# EAGLE design logic_unit (EAGLE 7.2.0)
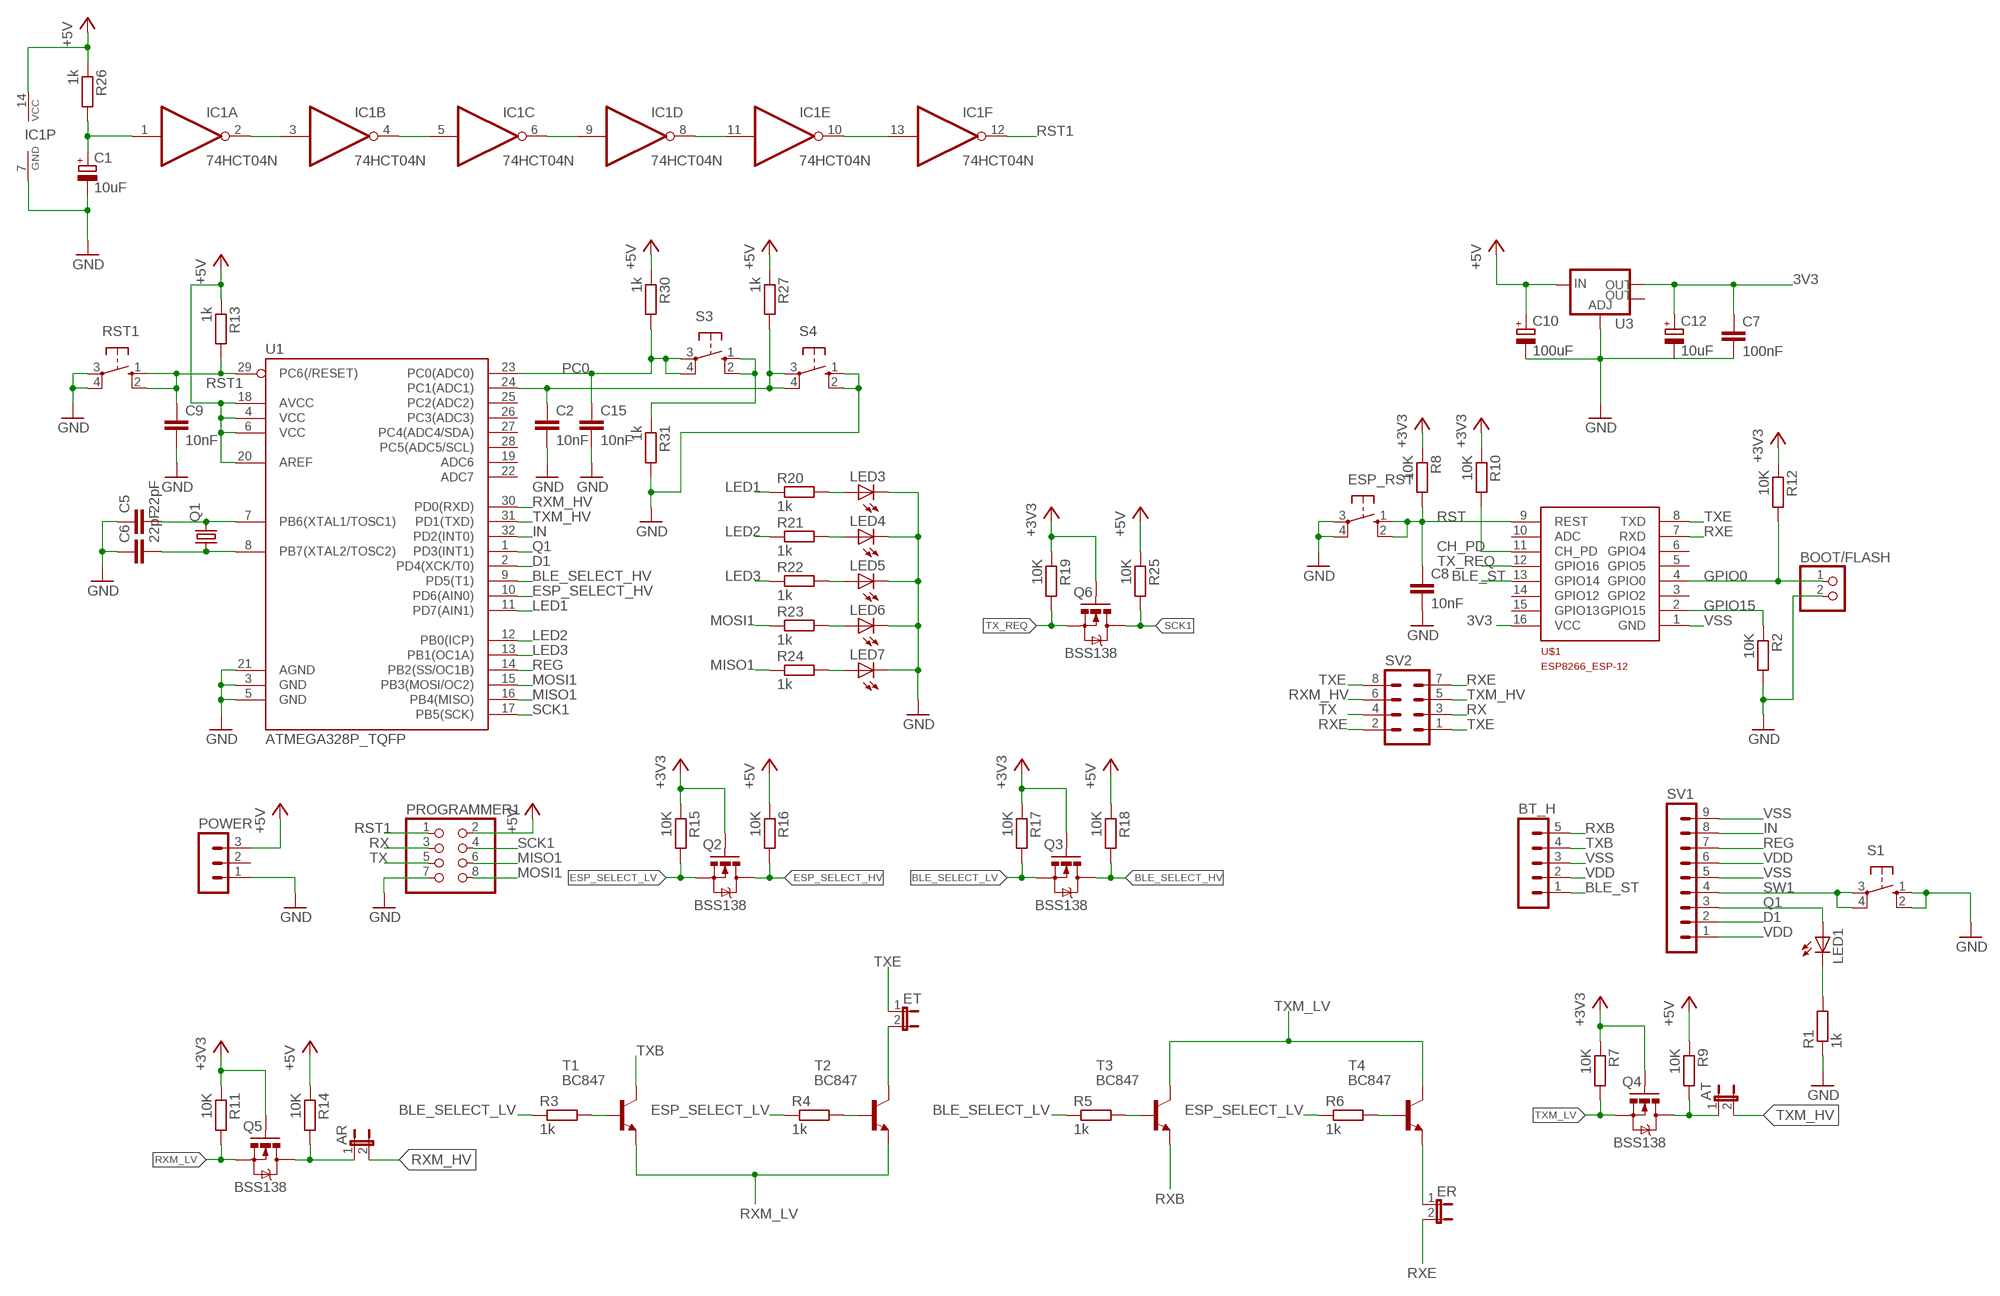
[diagram p0: schematic, sheet 1]

## Parts
AR  JP1E  [JP1]
AT  JP1E  [JP1]
BOOT/FLASH  PINHD-1X2  [1X02]
BT_H  MA05-1  [MA05-1]
C1  10uF  CPOL-EU153CLV-0405  [153CLV-0405]
C2  10nF  C-EUC1206  [C1206]
C5  22pF  C-EUC1206  [C1206]
C6  22pF  C-EUC1206  [C1206]
C7  100nF  C-EUC1206  [C1206]
C8  10nF  C-EUC1206  [C1206]
C9  10nF  C-EUC1206  [C1206]
C10  100uF  CPOL-EU153CLV-0605  [153CLV-0605]
C12  10uF  CPOL-EU153CLV-0405  [153CLV-0405]
C15  10nF  C-EUC1206  [C1206]
ER  JP1E  [JP1]
ESP_RST  10-XX  [B3F-10XX]
ET  JP1E  [JP1]
IC1  74HCT04N  [DIL14]
LED1  LED5MM  [LED5MM]
LED3  LED5MM  [LED5MM]
LED4  LED5MM  [LED5MM]
LED5  LED5MM  [LED5MM]
LED6  LED5MM  [LED5MM]
LED7  LED5MM  [LED5MM]
POWER  MA03-1  [MA03-1]
PROGRAMMER1  PINHD-2X4  [2X04]
Q1  CRYSTALHC49UP  [HC49UP]
Q2  BSS138  MOSFET-NCHANNELSMD  [SOT23-3]
Q3  BSS138  MOSFET-NCHANNELSMD  [SOT23-3]
Q4  BSS138  MOSFET-NCHANNELSMD  [SOT23-3]
Q5  BSS138  MOSFET-NCHANNELSMD  [SOT23-3]
Q6  BSS138  MOSFET-NCHANNELSMD  [SOT23-3]
R1  1k  R-EU_R1206  [R1206]
R2  10K  R-EU_R1206  [R1206]
R3  1k  R-EU_R1206  [R1206]
R4  1k  R-EU_R1206  [R1206]
R5  1k  R-EU_R1206  [R1206]
R6  1k  R-EU_R1206  [R1206]
R7  10K  R-EU_R1206  [R1206]
R8  10K  R-EU_R1206  [R1206]
R9  10K  R-EU_R1206  [R1206]
R10  10K  R-EU_R1206  [R1206]
R11  10K  R-EU_R1206  [R1206]
R12  10K  R-EU_R1206  [R1206]
R13  1k  R-EU_R1206  [R1206]
R14  10K  R-EU_R1206  [R1206]
R15  10K  R-EU_R1206  [R1206]
R16  10K  R-EU_R1206  [R1206]
R17  10K  R-EU_R1206  [R1206]
R18  10K  R-EU_R1206  [R1206]
R19  10K  R-EU_R1206  [R1206]
R20  1k  R-EU_R1206  [R1206]
R21  1k  R-EU_R1206  [R1206]
R22  1k  R-EU_R1206  [R1206]
R23  1k  R-EU_R1206  [R1206]
R24  1k  R-EU_R1206  [R1206]
R25  10K  R-EU_R1206  [R1206]
R26  1k  R-EU_R1206  [R1206]
R27  1k  R-EU_R1206  [R1206]
R30  1k  R-EU_R1206  [R1206]
R31  1k  R-EU_R1206  [R1206]
RST1  10-XX  [B3F-10XX]
S1  40-XX  [B3F-40XX]
S3  40-XX  [B3F-40XX]
S4  40-XX  [B3F-40XX]
SV1  MA09-1  [MA09-1]
SV2  MA04-2  [MA04-2]
T1  BC847  [SOT23]
T2  BC847  [SOT23]
T3  BC847  [SOT23]
T4  BC847  [SOT23]
U1  ATMEGA328P_TQFP  [TQFP32-08]
U3  V_REG_LM1117SOT223  [SOT223]
U$1  ESP8266_ESP-12  [ESP8266-ESP12]

## Nets
3V3: C7.1 C12.+ Q2.1(G) Q3.1(G) Q4.1(G) Q5.1(G) Q6.1(G) R7.1 R8.1 R10.1 R11.1 R12.1 R15.1 R17.1 R19.1 U3.2(OUT) U$1.16(VCC) ; supply symbol labelled +3V3
BLE_SELECT_HV: Q3.3(D) R18.2 U1.9(PD5(T1))
BLE_SELECT_LV: Q3.2(S) R3.1 R5.1 R17.2
BLE_ST: BT_H.1 U$1.13(GPIO14)
CH_PD: R10.2 U$1.11(CH_PD)
D1: SV1.2 U1.2(PD4(XCK/T0))
ESP_SELECT_HV: Q2.3(D) R16.2 U1.10(PD6(AIN0))
ESP_SELECT_LV: Q2.2(S) R4.1 R6.1 R15.2
GPIO0: BOOT/FLASH.1 R12.2 U$1.4(GPIO0)
GPIO15: R2.1 U$1.2(GPIO15)
IN: SV1.8 U1.32(PD2(INT0))
LED1: R20.1 U1.11(PD7(AIN1))
LED2: R21.1 U1.12(PB0(ICP))
LED3: R22.1 U1.13(PB1(OC1A))
MISO1: PROGRAMMER1.6 R24.1 U1.16(PB4(MISO))
MOSI1: PROGRAMMER1.8 R23.1 U1.15(PB3(MOSI/OC2))
N$1: R3.2 T1.1(B)
N$2: R4.2 T2.1(B)
N$3: R5.2 T3.1(B)
N$4: IC1.2(A:O) IC1.3(B:I)
N$5: LED1.K(C) R1.2
N$6: R6.2 T4.1(B)
N$7: IC1.4(B:O) IC1.5(C:I)
N$8: IC1.6(C:O) IC1.9(D:I)
N$9: IC1.8(D:O) IC1.11(E:I)
N$10: IC1.10(E:O) IC1.13(F:I)
N$11: C1.+ IC1.1(A:I) R26.2
N$12: C5.2 Q1.2 U1.7(PB6(XTAL1/TOSC1))
N$13: C2.1 R27.2 S4.3(P) S4.4(P1) U1.24(PC1(ADC1))
N$19: C6.2 Q1.1 U1.8(PB7(XTAL2/TOSC2))
N$25: LED3.A R20.2
N$30: LED4.A R21.2
N$33: LED5.A R22.2
N$36: LED6.A R23.2
N$39: LED7.A R24.2
N$45: R31.1 S3.1(S) S3.2(S1)
PC0: C15.1 R30.2 S3.3(P) S3.4(P1) U1.23(PC0(ADC0))
Q1: LED1.A SV1.3 U1.1(PD3(INT1))
REG: SV1.7 U1.14(PB2(SS/OC1B))
RST: C8.1 ESP_RST.1(S) ESP_RST.2(S1) R8.2 U$1.9(REST)
RST1: C9.1 IC1.12(F:O) PROGRAMMER1.1 R13.2 RST1.1(S) RST1.2(S1) U1.29(PC6(/RESET))
RX: PROGRAMMER1.3 SV2.3
RXB: BT_H.5 T3.2(E)
RXE: ER.2 SV2.2 SV2.7 U$1.7(RXD)
RXE_J: ER.1 T4.2(E)
RXM_HV: AR.2 SV2.6 U1.30(PD0(RXD))
RXM_HV_J: AR.1 Q5.3(D) R14.2
RXM_LV: Q5.2(S) R11.2 T1.2(E) T2.2(E)
SCK1: PROGRAMMER1.4 Q6.3(D) R25.2 U1.17(PB5(SCK))
SW1: S1.3(P) S1.4(P1) SV1.4
TX: PROGRAMMER1.5 SV2.4
TX_REQ: Q6.2(S) R19.2 U$1.12(GPIO16)
TXB: BT_H.4 T1.3(C)
TXE: ET.1 SV2.1 SV2.8 U$1.8(TXD)
TXE_J: ET.2 T2.3(C)
TXM_HV: AT.2 SV2.5 U1.31(PD1(TXD))
TXM_HV_J: AT.1 Q4.3(D) R9.2
TXM_LV: Q4.2(S) R7.2 T3.3(C) T4.3(C)
VDD: BT_H.2 C10.+ IC1.14(P:VCC) POWER.3 PROGRAMMER1.2 R9.1 R13.1 R14.1 R16.1 R18.1 R25.1 R26.1 R27.1 R30.1 SV1.1 SV1.6 U1.4(VCC) U1.6(VCC) U1.18(AVCC) U1.20(AREF) U3.3(IN) ; supply symbol labelled +5V
VSS: BOOT/FLASH.2 BT_H.3 C1.- C2.2 C5.1 C6.1 C7.2 C8.2 C9.2 C10.- C12.- C15.2 ESP_RST.3(P) ESP_RST.4(P1) IC1.7(P:GND) LED3.K(C) LED4.K(C) LED5.K(C) LED6.K(C) LED7.K(C) POWER.1 PROGRAMMER1.7 R1.1 R2.2 R31.2 RST1.3(P) RST1.4(P1) S1.1(S) S1.2(S1) S4.1(S) S4.2(S1) SV1.5 SV1.9 U1.3(GND) U1.5(GND) U1.21(AGND) U3.1(ADJ) U$1.1(GND) ; supply symbol labelled GND
Unconnected: POWER.2 U1.19(ADC6) U1.22(ADC7) U1.25(PC2(ADC2)) U1.26(PC3(ADC3)) U1.27(PC4(ADC4/SDA)) U1.28(PC5(ADC5/SCL)) U3.4(OUT) U$1.3(GPIO2) U$1.5(GPIO5) U$1.6(GPIO4) U$1.10(ADC) U$1.14(GPIO12) U$1.15(GPIO13)

## Library data of the parts
AR AT ER ET = jumper:JP1E: JUMPER
BOOT/FLASH = pinhead:PINHD-1X2: PIN HEADER
BT_H = con-lstb:MA05-1: PIN HEADER; OC_FARNELL: unknown; OC_NEWARK: unknown
C1 C10 C12 = resistor:CPOL-EU: POLARIZED CAPACITOR, European symbol
C2 C5-C9 C15 = rcl:C-EU: CAPACITOR, European symbol
ESP_RST RST1 = switch-omron:10-XX: OMRON SWITCH; MPN: B3F-1000; OC_FARNELL: 176432; OC_NEWARK: 36M3542
IC1 = 74xx-eu:74*04: Hex INVERTER
LED1 LED3-LED7 = adafruit:LED: LED OSRAM: - CHIPLED LG R971, LG N971, LY N971, LG Q971, LY Q971, LO R971, LY R971 LH N974, LH R974 LS Q976, LO Q976, LY Q976 LO Q996 - Hyper CHIPLED LW Q18S LB Q993, LB Q99A, LB R99A - SideLED LS A670, LO A670, LY A670, LG A670, LP A670 LB A673, LV A673, LT A673, LW A673 LH A674 LY A675 LS A676, LA A676, LO A676, LY A676, LW A676 LS A679, LY A679, LG A679 - Hyper Micro SIDELED® LS Y876, LA Y876, LO Y876, LY Y876 LT Y87S - SmartLED LW L88C, LW L88S LB L89C, LB L89S, LG L890 LS L89K, LO L89K, LY L89K LS L896, LA L896, LO L896, LY L896 - TOPLED LS T670, LO T670, LY T670, LG T670, LP T670 LSG T670, LSP T670, LSY T670, LOP T670, LYG T670 LG T671, LOG T671, LSG T671 LB T673, LV T673, LT T673, LW T673 LH T674 LS T676, LA T676, LO T676, LY T676, LB T676, LH T676, LSB T676, LW T676 LB T67C, LV T67C, LT T67C, LS T67K, LO T67K, LY T67K, LW E67C LS E67B, LA E67B, LO E67B, LY E67B, LB E67C, LV E67C, LT E67C LW T67C LS T679, LY T679, LG T679 LS T770, LO T770, LY T770, LG T770, LP T770 LB T773, LV T773, LT T773, LW T773 LH T774 LS E675, LA E675, LY E675, LS T675 LS T776, LA T776, LO T776, LY T776, LB T776 LHGB T686 LT T68C, LB T68C - Hyper Mini TOPLED® LB M676 - Mini TOPLED Santana® LG M470 LS M47K, LO M47K, LY M47K Source: http://www.osram.convergy.de/
POWER = con-lstb:MA03-1: PIN HEADER; OC_FARNELL: unknown; OC_NEWARK: unknown
PROGRAMMER1 = pinhead:PINHD-2X4: PIN HEADER
Q1 = crystal:CRYSTAL: CRYSTAL; OC_FARNELL: unknown; OC_NEWARK: unknown
Q2-Q6 = SparkFun:MOSFET-NCHANNEL
R1-R27 R30 R31 = rcl:R-EU_: RESISTOR, European symbol
S1 S3 S4 = switch-omron:40-XX: OMRON SWITCH; MF: OMRON COMPONENTS USA; MPN: B3F-4000; OC_FARNELL: 176434; OC_NEWARK: 36K3105
SV1 = con-lstb:MA09-1: PIN HEADER; OC_FARNELL: unknown; OC_NEWARK: unknown
SV2 = con-lstb:MA04-2: PIN HEADER; OC_FARNELL: unknown; OC_NEWARK: unknown
T1-T4 = transistor-neu-to92:BC847: NPN TRANSISTOR
U1 = SparkFun-DigitalIC:ATMEGA328P_TQFP; PROD_ID: IC-09069
U3 = SparkFun-PowerIC:V_REG_LM1117: Voltage Regulator LM1117 Standard adjustable voltage regulator but in SMD form. Spark Fun Electronics SKU : COM-00595; PROD_ID: VREG-08170
U$1 = ESP8266-ESP12:ESP8266_ESP-12

## Board
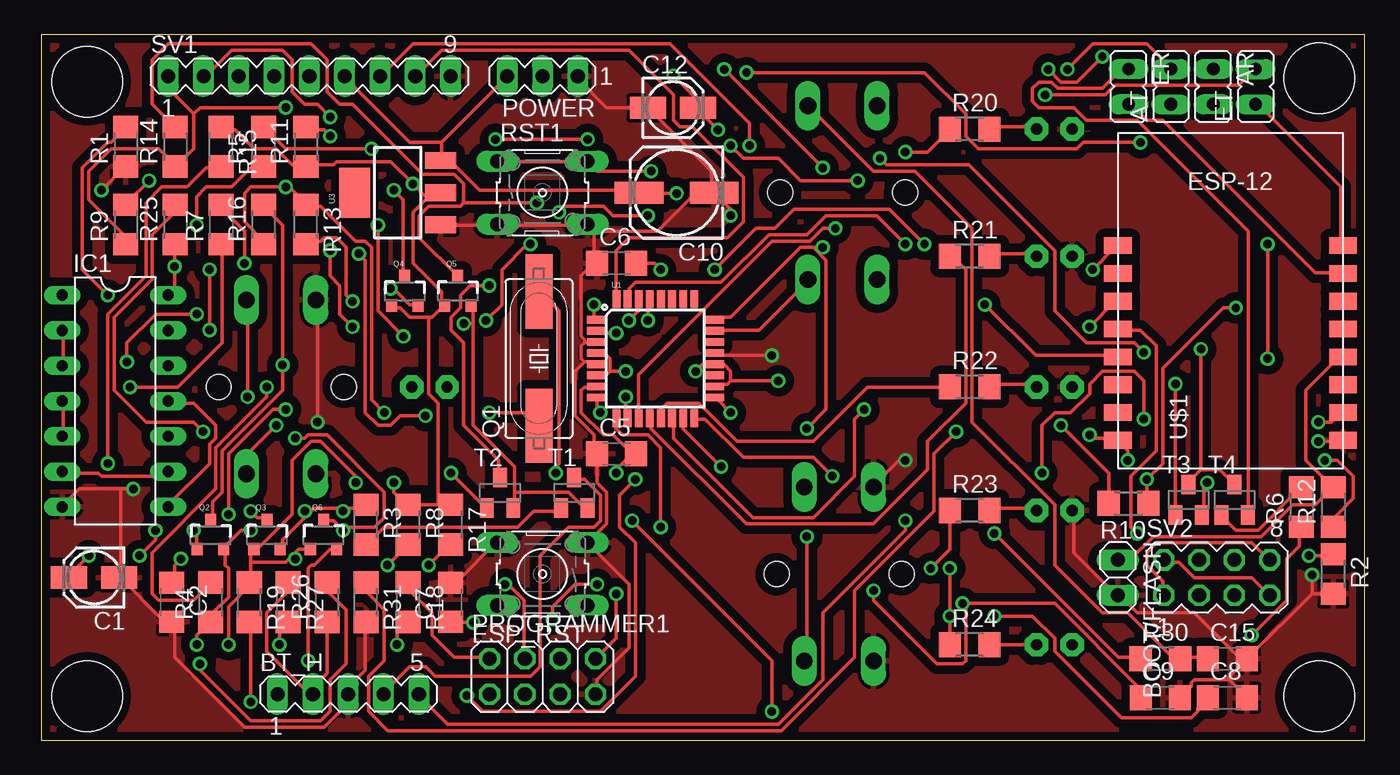
[diagram p1: board, top side]
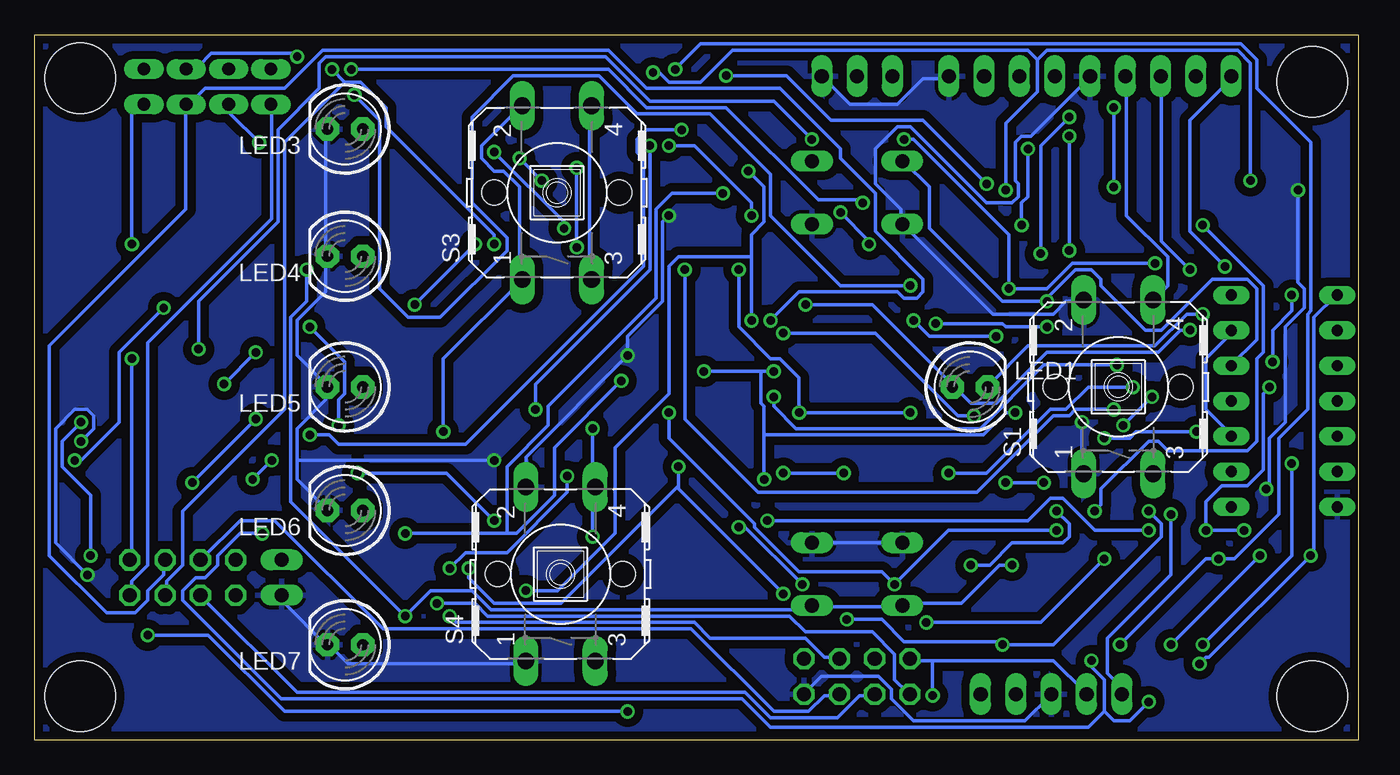
[diagram p2: board, bottom side, seen from below]

Size 95.23 x 50.72 mm. Coordinates in mm from the lower left corner, seen from the top.
Outline: 0,0 95.23,0 95.23,50.72 0,50.72 0,0
Copper layers (1*16): Top 0.035mm / dielectric 1.5mm / Bottom 0.035mm
Design rules "default *": minimum track width 10mil, minimum drill 24mil, track to track 8mil, track to pad 8mil, pad to pad 8mil, via to via 8mil, smd to smd 8mil, copper to edge 20mil, drill to drill 8mil, minimum pad ring 10mil, minimum via ring 8mil, stop-mask expansion 4mil, vias tented up to drill 0mil, thermal gap 10mil
Holes 5.08 mm at 3.31,47.36 91.95,47.61 91.95,3.16 3.31,3.16

### Footprints (pad centres in the part's own frame; a part is rotated, then mirrored left to right if it is on the bottom)
JP1 = drill 0.914 long: 1 0,-1.27; 2 0,1.27
1X02 = drill 1.016 long: 1 -1.27,0; 2 1.27,0
MA05-1 = drill 1.016 long: 1 -5.08,0; 2 -2.54,0; 3 0,0; 4 2.54,0; 5 5.08,0
153CLV-0405 = smd 2.6 x 1.6: + 1.8,0; - -1.8,0
C1206 = smd 1.6 x 1.8: 1 -1.4,0; 2 1.4,0
153CLV-0605 = smd 3.5 x 1.6: + 2.7,0; - -2.7,0
B3F-10XX = drill 1.016 long: 1 -3.251,2.261; 2 3.251,2.261; 3 -3.251,-2.261; 4 3.251,-2.261
DIL14 = drill 0.813 long: 1 -7.62,-3.81; 2 -5.08,-3.81; 3 -2.54,-3.81; 4 0,-3.81; 5 2.54,-3.81; 6 5.08,-3.81; 7 7.62,-3.81; 8 7.62,3.81; 9 5.08,3.81; 10 2.54,3.81; 11 0,3.81; 12 -2.54,3.81; 13 -5.08,3.81; 14 -7.62,3.81
LED5MM = drill 0.813 pad 1.676 octagon: A -1.27,0; K 1.27,0
MA03-1 = drill 1.016 long: 1 -2.54,0; 2 0,0; 3 2.54,0
2X04 = drill 1.016 octagon: 1 -3.81,-1.27; 2 -3.81,1.27; 3 -1.27,-1.27; 4 -1.27,1.27; 5 1.27,-1.27; 6 1.27,1.27; 7 3.81,-1.27; 8 3.81,1.27
HC49UP = smd 5.334 x 1.93: 1 -4.826,0; 2 4.826,0
SOT23-3 = smd 0.8 x 0.9: 1 -0.95,-1; 2 0.95,-1; 3 0,1.1
R1206 = smd 1.6 x 1.803: 1 -1.422,0; 2 1.422,0
B3F-40XX = drill 1.194 long: 1 -6.248,2.489; 2 6.248,2.489; 3 -6.248,-2.489; 4 6.248,-2.489 | hole 1.803: 0,-4.496; 0,4.496
MA09-1 = drill 1.016 long: 1 -10.16,0; 2 -7.62,0; 3 -5.08,0; 4 -2.54,0; 5 0,0; 6 2.54,0; 7 5.08,0; 8 7.62,0; 9 10.16,0
MA04-2 = drill 1.016 octagon: 1 -3.81,-1.27; 2 -3.81,1.27; 3 -1.27,-1.27; 4 -1.27,1.27; 5 1.27,-1.27; 6 1.27,1.27; 7 3.81,-1.27; 8 3.81,1.27
SOT23 = smd 1 x 1.4: 1 -0.95,-1.1; 2 0.95,-1.1; 3 0,1.1
TQFP32-08 = smd 1.27 x 0.559: 1 -4.293,2.8; 2 -4.293,2; 3 -4.293,1.2; 4 -4.293,0.4; 5 -4.293,-0.4; 6 -4.293,-1.2; 7 -4.293,-2; 8 -4.293,-2.8; 17 4.293,-2.8; 18 4.293,-2; 19 4.293,-1.2; 20 4.293,-0.4; 21 4.293,0.4; 22 4.293,1.2; 23 4.293,2; 24 4.293,2.8 | smd 0.559 x 1.27: 9 -2.8,-4.293; 10 -2,-4.293; 11 -1.2,-4.293; 12 -0.4,-4.293; 13 0.4,-4.293; 14 1.2,-4.293; 15 2,-4.293; 16 2.8,-4.293; 25 2.8,4.293; 26 2,4.293; 27 1.2,4.293; 28 0.4,4.293; 29 -0.4,4.293; 30 -1.2,4.293; 31 -2,4.293; 32 -2.8,4.293
SOT223 = smd 1.219 x 2.235: 1 -2.311,-3.099; 2 0,-3.099; 3 2.311,-3.099 | smd 3.6 x 2.2: 4 0,3.099
ESP8266-ESP12 = smd 2 x 1.2: 1 16.2,2; 2 16.2,4; 3 16.2,6; 4 16.2,8; 5 16.2,10; 6 16.2,12; 7 16.2,14; 8 16.2,16; 9 0,16; 10 0,14; 11 0,12; 12 0,10; 13 0,8; 14 0,6; 15 0,4; 16 0,2

### Placement (x,y rotation side)
AR  84.33,46.99 180 top
AT  81.28,46.99 0 top
BOOT/FLASH  77.47,11.68 270 top
BT_H  22.1,3.3 0 top
C1  3.81,11.68 180 top
C2  9.4,9.91 270 top
C5  41.4,20.57 0 top
C6  41.4,34.29 0 top
C7  29.46,9.91 90 top
C8  85.34,3.05 0 top
C9  80.52,3.05 0 top
C10  45.72,39.37 180 top
C12  45.47,45.47 0 top
C15  85.34,5.84 0 top
ER  78.23,46.99 180 top
ESP_RST  36.07,11.94 180 top
ET  87.38,46.99 0 top
IC1  5.33,24.38 270 top
LED1  27.94,25.4 0 bottom
LED3  72.9,43.94 180 bottom
LED4  72.9,34.8 180 bottom
LED5  72.9,25.4 180 bottom
LED6  72.9,16.51 180 bottom
LED7  72.9,6.86 180 bottom
POWER  36.07,47.75 180 top
PROGRAMMER1  36.07,4.57 0 top
Q1  35.81,27.43 90 top
Q2  12.19,14.73 0 top
Q3  16.26,14.73 0 top
Q4  26.16,32.26 0 top
Q5  29.97,32.26 0 top
Q6  20.32,14.73 0 top
R1  6.1,42.67 90 top
R2  92.96,11.94 270 top
R3  23.37,15.49 270 top
R4  12.19,9.91 90 top
R5  16,42.67 90 top
R6  90.68,16.76 90 top
R7  12.95,37.08 90 top
R8  26.42,15.49 270 top
R9  6.1,37.08 90 top
R10  78.23,17.02 180 top
R11  19.05,42.67 90 top
R12  92.96,16.76 90 top
R13  19.05,37.08 270 top
R14  9.65,42.67 90 top
R15  12.95,42.67 270 top
R16  16,37.08 90 top
R17  29.46,15.49 270 top
R18  26.42,9.91 270 top
R19  14.99,9.91 270 top
R20  66.8,43.94 0 top
R21  66.8,34.8 0 top
R22  66.8,25.4 0 top
R23  66.8,16.51 0 top
R24  66.8,6.86 0 top
R25  9.65,37.08 90 top
R26  20.57,9.91 90 top
R27  17.78,9.91 270 top
R30  80.52,5.84 0 top
R31  23.37,9.91 270 top
RST1  36.07,39.37 0 top
S1  17.27,25.4 90 bottom
S3  57.66,39.37 90 bottom
S4  57.4,11.94 90 bottom
SV1  19.3,47.75 0 top
SV2  84.58,11.68 0 top
T1  38.35,17.78 0 top
T2  33.02,17.78 0 top
T3  82.55,17.27 0 top
T4  85.85,17.27 0 top
U1  44.2,27.43 0 top
U3  25.65,39.37 90 top
U$1  77.47,19.56 0 top

### Tracks (layer width: path | path; a pad name or v marks a point on that pad's centre or on a via)
3V3  (via drill 0.61)
  Top 0.254: v78.18,20.12 78.18,20.8 77.5,21.49 U$1.16 77.27,21.72 75.67,21.72 v75.44,21.95 | R10.1 79.55,17.14 v79.55,18.75 80.7,19.89 80.7,26.75 85.04,31.09 v85.95,31.09 | v92.35,20.12 93.27,20.12 94.41,18.97 94.41,17.37 93.04,16 93.04,15.54 R12.1 | v10.97,15.09 11.2,14.86 11.2,13.95 Q2.1 | v6.4,25.38 9.83,25.38 13.03,28.57 13.03,35.66 R7.1 | 15.09,12.8 15.09,11.43 R19.1 15.09,11.2 13.49,9.6 v13.49,6.86 | 15.09,12.8 15.09,13.72 Q3.1 15.32,13.95 15.77,13.95 18.06,16.23 18.06,20.12 19.43,21.49 20.12,21.49 22.63,18.97 v22.63,18.52 | 18.06,13.26 17.6,12.8 15.09,12.8 | 18.06,13.26 18.52,13.72 19.2,13.72 Q6.1 | v31.09,8.46 29.49,8.46 C7.1 | 18.06,13.26 v18.29,13.03 | R15.1 13.03,43.89 13.95,43.89 15.32,42.52 16.92,42.52 18.06,41.38 18.97,41.38 R11.1 19.2,41.38 21.03,41.38 21.26,41.6 25.15,41.6 v26.75,40.01 27.66,39.09 27.89,39.09 | 28.57,16.92 29.26,16.92 R17.1 28.57,16.92 | 28.57,16.92 26.52,16.92 R8.1 26.29,16.92 25.38,17.83 v25.38,18.52 | 27.89,30.4 28.12,30.4 28.8,31.09 Q5.1 28.8,31.32 28.8,32.23 26.75,34.29 26.75,37.95 27.89,39.09 | 27.89,30.4 26.52,30.4 25.83,31.09 25.38,31.09 Q4.1 | 27.89,39.09 28.12,39.32 28.57,39.32 U3.2 27.89,39.09 | v45.49,47.78 47.09,46.18 47.09,45.49 C12.+ 47.32,45.26 v48.69,43.89 | 28.57,16.92 28.57,24.23 27.89,24.92 27.89,30.4 | v8.23,15.09 8.23,14.4 v7.09,13.26
  Bottom 0.254: v78.18,20.12 v79.55,18.75 | v92.35,20.12 91.9,20.12 89.15,22.86 89.15,27.89 v85.95,31.09 | v6.4,25.38 6.86,24.92 6.86,19.43 8,18.29 9.83,18.29 10.97,17.14 v10.97,15.09 v8.23,15.09 | v31.09,8.46 22.86,8.46 v18.29,13.03 | v45.49,47.78 41.15,47.78 37.95,44.58 31.32,44.58 v26.75,40.01 | v25.38,18.52 v22.63,18.52 | v13.49,6.86 v7.09,13.26 | v75.44,21.95 74.07,21.95 73.38,21.26 64.24,21.26 51.44,34.06 51.44,41.83 51.89,42.29 51.89,43.2 51.21,43.89 v48.69,43.89
BLE_SELECT_HV  (via drill 0.61)
  Top 0.254: v15.09,16.46 15.54,16 16.23,16 Q3.3 | v25.6,6.86 25.6,7.77 26.29,8.46 R18.2 | v44.58,15.32 44.58,21.03 43.66,21.95 41.83,21.95 41.38,22.4 41.38,23.09 U1.9 | v40.01,11.2 38.41,11.2 36.8,9.6 v36.8,8.69
  Bottom 0.254: v15.09,16.46 14.17,15.54 14.17,14.63 21.95,6.86 v25.6,6.86 25.83,7.09 32.69,7.09 34.29,8.69 v36.8,8.69 | v44.58,15.32 44.12,15.32 v40.01,11.2
BLE_SELECT_LV  (via drill 0.61)
  Top 0.254: 19.2,16.23 19.66,16.69 21.72,16.69 | 19.2,16.23 17.37,14.4 17.37,13.95 Q3.2 | 21.72,16.69 23.32,16.69 R3.1 | v11.2,37.03 11.2,39.09 11.89,39.78 13.72,39.78 15.09,41.15 16,41.15 R5.1 | 19.2,16.23 v18.97,16.46 | v27.89,12.57 29.26,13.95 R17.2 | 21.72,16.69 v21.72,16.46
  Bottom 0.254: v11.2,37.03 6.86,32.69 6.86,27.89 7.32,27.43 7.32,21.49 8,20.8 13.72,20.8 14.4,21.49 15.09,21.49 18.52,18.06 18.52,16.92 v18.97,16.46 | v27.89,12.57 26.52,12.57 24.92,14.17 21.26,14.17 20.8,14.63 20.8,15.54 v21.72,16.46
BLE_ST  (via drill 0.61)
  Top 0.254: v67.89,31.32 71.55,27.66 77.27,27.66 U$1.13 | v63.55,35.66 61.04,38.18 54.18,38.18 52.81,36.8 51.44,36.8 v48.46,33.83 | v17.6,23.77 16.69,23.77 13.49,20.57 v13.49,16.23
  Bottom 0.254: v63.55,35.66 v67.89,31.32 | v48.46,33.83 48.46,23.09 43.2,17.83 27.43,17.83 21.95,23.32 20.8,23.32 20.34,23.77 v17.6,23.77 | v13.49,16.23 13.49,11.89 18.06,7.32 18.06,4.8 17.14,3.89 17.14,3.43 BT_H.1
CH_PD  (via drill 0.61)
  Top 0.254: v73.38,22.63 76.81,19.2 76.81,17.14 R10.2 | v75.44,29.72 77.27,31.55 U$1.11
  Bottom 0.254: v73.38,22.63 73.38,24.46 72.92,24.92 72.92,27.2 v75.44,29.72
D1  (via drill 0.61)
  Top 0.254: v41.38,29.26 40.01,29.26 U1.2 | v27.66,23.32 25.83,23.32 25.15,22.63 24.23,22.63 23.32,23.55 23.32,34.52 v22.86,34.98 | v20.8,44.81 19.89,45.72 18.97,45.72 18.06,46.63 18.06,48.92 17.37,49.61 13.72,49.61 11.89,47.78 SV1.2
  Bottom 0.254: v41.38,29.26 34.75,29.26 28.8,23.32 v27.66,23.32 | v22.86,34.98 22.86,42.75 v20.8,44.81
ESP_SELECT_HV  (via drill 0.61)
  Top 0.254: Q2.3 12.34,16 12.34,17.14 13.03,17.83 13.03,20.8 17.37,25.15 v17.37,26.98 17.37,37.03 16,38.41 R16.2 | v42.06,24.69 42.06,23.32 U1.10
  Bottom 0.254: v42.06,24.69 42.06,24 40.46,22.4 27.2,22.4 22.63,26.98 v17.37,26.98
ESP_SELECT_LV  (via drill 0.61)
  Top 0.254: v4.8,19.89 4.8,30.63 7.54,33.38 7.54,38.63 8.69,39.78 10.52,39.78 11.89,41.15 12.8,41.15 R15.2 | v11.2,6.86 11.2,7.54 12.12,8.46 R4.1 12.34,8.69 12.34,9.14 13.49,10.29 13.49,12.34 13.26,12.57 13.26,13.72 Q2.2 13.26,13.95 14.4,15.09 v15.09,15.09 | v87.1,7.54 89.61,10.06 89.61,13.03 90.53,13.95 90.53,15.32 R6.1 | v52.58,2.06 52.58,5.71 v42.52,15.77
  Bottom 0.254: v4.8,19.89 4.8,13.26 v11.2,6.86 | v87.1,7.54 82.75,7.54 77.27,2.06 v52.58,2.06 | v42.52,15.77 23.77,15.77 22.17,17.37 21.26,17.37 18.97,15.09 v15.09,15.09
GPIO0
  Top 0.254: U$1.4 93.5,27.66 90.98,25.15 90.98,20.12 92.81,18.29 R12.2 92.81,18.06 91.67,16.92 90.07,16.92 87.78,14.63 80.01,14.63 78.41,13.03 77.5,13.03 BOOT/FLASH.1
GPIO15  (via drill 0.61)
  Top 0.254: v91.21,13.26 92.81,13.26 R2.1 | v91.9,22.86 92.81,22.86 93.5,23.55 U$1.2
  Bottom 0.254: v91.21,13.26 91.21,17.6 93.27,19.66 93.27,21.49 v91.9,22.86
IN
  Top 0.254: U1.32 41.38,31.77 41.38,35.2 42.29,36.12 49.38,36.12 50.52,37.26 50.52,40.46 46.86,44.12 45.95,44.12 45.49,44.58 45.49,46.41 42.29,49.61 28.8,49.61 26.98,47.78 SV1.8
LED1  (via drill 0.61)
  Top 0.254: v57.15,36.8 56.24,36.8 55.32,35.89 52.58,35.89 42.98,26.29 42.98,23.32 U1.11 | v62.18,42.29 63.78,42.29 65.38,43.89 R20.1
  Bottom 0.254: v57.15,36.8 57.15,37.26 v62.18,42.29
LED2
  Top 0.254: U1.12 43.89,23.09 43.89,22.4 50.75,15.54 59.89,15.54 63.78,19.43 63.78,21.49 66.52,24.23 66.52,33.83 65.61,34.75 R21.1
LED3
  Top 0.254: U1.13 44.58,23.32 44.58,23.77 45.03,24.23 47.32,24.23 50.06,21.49 55.55,21.49 59.44,25.38 65.38,25.38 R22.1
MISO1  (via drill 0.61)
  Top 0.254: v56.92,18.97 55.55,20.34 50.52,20.34 47.78,23.09 47.09,23.09 U1.16 | R24.1 v65.38,8.91 v65.38,12.34 | R24.1
  Bottom 0.254: v56.92,18.97 56.92,17.83 61.27,13.49 64.24,13.49 v65.38,12.34 | v65.38,8.91 64.92,8.46 47.78,8.46 46.63,7.32 39.78,7.32 38.41,5.94 37.49,5.94 PROGRAMMER1.6
MOSI1  (via drill 0.61)
  Top 0.254: v48.92,19.66 46.18,22.4 46.18,23.09 U1.15 | v41.38,10.52 41.38,7.32 40.01,5.94 PROGRAMMER1.8 | v64.01,12.34 65.38,13.72 65.38,16.46 R23.1
  Bottom 0.254: 48.92,18.29 48.92,18.06 v41.38,10.52 | 48.92,18.29 v48.92,19.66 | v64.01,12.34 64.01,11.66 62.18,9.83 57.38,9.83 48.92,18.29
N$1
  Top 0.254: T1.1 37.26,16.46 35.43,16.46 34.29,15.32 24.69,15.32 23.55,14.17 R3.2
N$2  (via drill 0.61)
  Top 0.254: v29.49,19.2 32,16.69 T2.1 | v16.23,25.38 16.23,24.69 12.57,21.03 12.57,18.06 8,13.49 8,10.52 8.46,10.06 10.97,10.06 12.12,11.2 R4.2
  Bottom 0.254: v29.49,19.2 26.75,19.2 22.17,23.77 21.03,23.77 19.43,25.38 v16.23,25.38
N$3  (via drill 0.61)
  Top 0.254: v81.61,25.6 81.61,16.23 T3.1 | v79.32,27.89 78.64,28.57 75.21,28.57 72.92,30.86 72.92,35.2 66.75,41.38 60.81,41.38 v60.35,41.83 | v58.75,40.23 54.63,40.23 53.03,41.83 50.52,41.83 v49.61,42.75 | v43.66,37.72 41.15,37.72 40.46,38.41 37.72,38.41 v37.26,37.95 | v35.2,35.66 34.98,35.66 33.15,33.83 33.15,31.32 v32,30.18 | v26.06,29.03 24.23,30.86 v24.23,37.03 | v23.77,42.52 17.6,42.52 16,44.12 R5.2
  Bottom 0.254: v79.32,27.89 v81.61,25.6 | v58.75,40.23 v60.35,41.83 | v49.61,42.75 47.78,42.75 43.66,38.63 v43.66,37.72 | v37.26,37.95 35.2,35.89 v35.2,35.66 | v32,30.18 30.86,29.03 v26.06,29.03 | v24.23,37.03 24.23,38.63 23.77,39.09 v23.77,42.52
N$4
  Top 0.254: IC1.3 1.6,26.98 1.6,29.26 IC1.2
N$5  (via drill 0.61)
  Top 0.254: v4.8,32 2.97,33.83 2.97,41.15 4.8,42.98 5.03,42.98 5.94,43.89 R1.2 | v6.17,27.2 6.17,28.57 8.23,30.63 v11.2,30.63
  Bottom 0.254: v4.8,32 4.8,30.86 6.17,29.49 v6.17,27.2 | v11.2,30.63 12.34,30.63 14.63,28.35 23.77,28.35 26.52,25.6 LED1.K
N$6
  Top 0.254: T4.1 85.04,16 85.95,15.09 87.55,15.09 90.53,18.06 R6.2
N$7
  Top 0.254: IC1.5 1.6,21.95 1.6,24.23 IC1.4
N$8
  Top 0.254: IC1.6 1.6,19.2 4.12,19.2 4.34,18.97 8.91,18.97 9.14,19.2 IC1.9
N$9
  Top 0.254: IC1.8 9.14,16.92 12.12,19.89 12.12,21.26 12.57,21.72 12.57,22.63 10.97,24.23 9.14,24.23 IC1.11
N$10
  Bottom 0.254: IC1.10 9.14,21.95 10.97,23.77 10.97,27.43 9.14,29.26 IC1.13
N$11  (via drill 0.61)
  Top 0.254: R26.2 20.57,10.74 21.95,9.37 21.95,5.49 20.8,4.34 20.8,2.06 20.12,1.37 15.09,1.37 11.43,5.03 v11.43,5.49 | v3.43,13.26 2.06,11.89 C1.+
  Bottom 0.254: v11.43,5.49 10.97,5.94 10.74,5.94 v3.43,13.26 3.2,13.49 3.2,30.4 1.6,32 IC1.1
N$12  (via drill 0.61)
  Top 0.254: 42.52,20.57 41.15,21.95 40.46,21.95 38.86,23.55 38.86,25.15 39.09,25.38 39.78,25.38 U1.7 | 42.52,20.57 C5.2 42.75,20.57 | 42.52,20.57 41.38,19.43 v41.38,19.2 | v37.03,19.2 37.03,19.66 37.26,19.89 37.26,30.86 35.89,32.23 Q1.2
  Bottom 0.254: v37.03,19.2 v41.38,19.2
N$13  (via drill 0.61)
  Top 0.254: v10.06,13.03 9.6,12.57 9.6,11.43 C2.1 | v17.14,6.86 17.14,8 17.6,8.46 R27.2 | 55.55,35.43 54.63,35.43 49.61,30.4 48.69,30.4 U1.24 | 55.55,35.43 56.46,34.52 56.46,23.77 v55.09,22.4 | v55.09,14.63 55.09,5.71 S4.3 | v56.24,41.15 v49.15,48.23 | 55.55,35.43 v56.24,35.43
  Bottom 0.254: v17.14,6.86 10.97,13.03 v10.06,13.03 8.91,13.03 5.71,16.23 5.71,21.72 3.66,23.77 3.66,30.63 3.43,30.86 3.43,42.98 7.32,46.86 7.32,48.92 8.46,50.06 47.32,50.06 v49.15,48.23 | v55.09,22.4 55.09,18.29 S4.4 55.09,18.06 v55.09,14.63 | v56.24,35.43 v56.24,41.15
N$19  (via drill 0.61)
  Top 0.254: v40.23,23.55 40.01,23.77 40.01,24.46 U1.8 | v32.23,23.55 34.75,23.55 35.66,22.63 Q1.1 | C6.2 44.12,34.29 v44.58,33.83
  Bottom 0.254: v32.23,23.55 v40.23,23.55 40.23,26.06 41.6,27.43 42.29,27.43 44.58,29.72 v44.58,33.83
N$25
  Top 0.254: R20.2 68.35,44.12 71.55,44.12 LED3.A
N$30
  Top 0.254: R21.2 68.35,34.98 71.55,34.98 LED4.A
N$33
  Top 0.254: R22.2 68.35,25.6 71.55,25.6 LED5.A
N$36
  Top 0.254: R23.2 68.35,16.69 71.55,16.69 LED6.A
N$39
  Top 0.254: LED7.A R24.2
N$45  (via drill 0.61)
  Top 0.254: v65.84,22.17 64.24,20.57 64.24,16.46 58.52,10.74 58.52,5.94 53.26,0.69 24.92,0.69 23.55,2.06 23.55,4.57 24.69,5.71 24.69,9.37 23.55,10.52 23.55,11.2 R31.1
  Bottom 0.254: v65.84,22.17 65.84,27.43 S3.1 60.35,33.15 60.35,39.78 61.49,40.92 62.18,40.92 63.09,41.83 63.09,42.75 60.35,45.49 S3.2
PC0
  Top 0.254: U1.23 48.69,29.49 51.66,29.49 55.09,32.92 S3.3 | C15.1 83.9,5.94 82.07,5.94 R30.2 81.84,5.94 81.38,5.94 78.18,9.14 76.35,9.14 72.92,12.57 72.92,16.92 66.98,22.86 66.98,36.8 62.87,40.92 59.89,40.92 55.32,45.49 S3.4
  Bottom 0.254: S3.3 55.32,33.15 55.32,45.49 S3.4
Q1  (via drill 0.61)
  Top 0.254: v39.78,31.32 39.78,30.4 U1.1 | v12.12,29.49 v12.12,33.83
  Bottom 0.254: v39.78,31.32 34.98,31.32 29.26,25.6 LED1.A 29.03,25.38 27.89,24.23 26.06,24.23 22.4,27.89 14.4,27.89 12.8,29.49 v12.12,29.49 | v12.12,33.83 14.17,35.89 14.17,47.55 SV1.3
REG  (via drill 0.61)
  Top 0.254: v59.21,23.77 58.52,23.09 58.52,18.97 55.55,16 51.21,16 45.49,21.72 45.49,23.09 U1.14 | v50.98,42.75 50.98,44.35 45.26,50.06 26.75,50.06 24.46,47.78 SV1.7
  Bottom 0.254: v59.21,23.77 59.21,25.6 50.98,33.83 v50.98,42.75
RST  (via drill 0.61)
  Top 0.254: v24.92,12.57 26.29,13.95 R8.2 | v68.58,8.91 71.32,8.91 72.92,7.32 72.92,6.4 77.72,1.6 82.75,1.6 83.21,2.06 83.21,2.29 83.9,2.97 C8.1 | v75.67,33.83 77.27,35.43 U$1.9
  Bottom 0.254: v24.92,12.57 25.83,12.57 28.57,9.83 32.69,9.83 ESP_RST.2 32.92,9.6 39.32,9.6 | 39.32,9.6 39.55,9.37 62.41,9.37 63.78,10.74 66.75,10.74 v68.58,8.91 76.81,17.14 76.81,30.4 75.67,31.55 v75.67,33.83 | 39.32,9.6 ESP_RST.1
RST1  (via drill 0.61)
  Top 0.254: v43.66,30.18 43.66,31.55 U1.29 | v43.89,40.92 40.01,40.92 39.32,41.6 | v22.4,31.55 21.95,32 21.95,35.43 21.26,36.12 20.34,36.12 20.12,35.89 19.2,35.89 R13.2 | 39.32,41.6 32.92,41.6 RST1.1 | 39.32,41.6 RST1.2 | 66.52,9.83 72.92,9.83 79.1,3.66 79.1,3.2 C9.1 | v59.89,10.74 59.89,10.06 64.47,5.49 66.29,5.49 66.52,5.71 66.52,9.83 | 66.52,9.83 v66.29,9.83
  Bottom 0.254: 43.66,34.75 43.66,36.35 42.75,37.26 42.75,39.78 v43.89,40.92 | 43.66,34.75 v43.66,30.18 | 22.63,31.55 25.6,31.55 30.86,36.8 30.86,39.78 32.69,41.6 RST1.1 | 22.63,31.55 20.34,33.83 19.2,33.83 18.52,33.15 18.52,32.69 15.32,29.49 14.17,29.49 10.52,33.15 8,33.15 7.32,32.46 7.32,28.8 9.14,26.98 IC1.12 | 22.63,31.55 v22.4,31.55 | v66.29,9.83 63.55,9.83 62.64,8.91 40.92,8.91 39.78,7.77 34.98,7.77 33.38,6.17 33.38,4.34 32.46,3.43 PROGRAMMER1.1 | 43.66,34.75 48.92,34.75 49.61,34.06 49.61,24.92 53.49,21.03 53.49,14.86 57.61,10.74 v59.89,10.74
RX
  Bottom 0.254: PROGRAMMER1.3 34.98,3.2 35.89,3.2 37.49,1.6 42.29,1.6 44.12,3.43 76.35,3.43 83.21,10.29 SV2.3
RXB  (via drill 0.61)
  Top 0.254: v83.9,18.52 83.67,18.29 83.67,16.23 T3.2 | v79.32,23.09 79.32,25.83 78.64,26.52 76.35,26.52 75.44,25.6 75.44,24.92 74.07,23.55 72.92,23.55 72.01,22.63 v72.01,19.2 | v62.18,15.77 62.18,15.09 56.24,9.14 56.24,4.34 53.03,1.14 29.26,1.14 27.2,3.2 BT_H.5
  Bottom 0.254: v79.32,23.09 v83.9,18.52 | v72.01,19.2 65.61,19.2 v62.18,15.77
RXE
  Top 0.254: SV2.2 80.92,12.8 81.84,12.8 82.98,11.66 87.1,11.66 88.24,10.52 SV2.7 | U$1.7 93.5,33.6 91.67,33.6 80.7,44.58 79.55,44.58 78.41,45.72 ER.2
  Bottom 0.254: SV2.7 88.24,10.52 88.24,11.43 87.1,12.57 87.1,28.57 78.18,37.49 78.18,45.72 ER.2
RXE_J
  Top 0.254: T4.2 86.87,16.23 86.87,36.58 78.87,44.58 75.21,44.58 74.3,45.49 71.78,45.49 71.32,45.95 71.32,46.86 71.78,47.32 72.69,47.32 73.15,46.86 76.35,46.86 77.72,48.23 78.18,48.23 ER.1
RXM_HV  (via drill 0.61)
  Top 0.254: v42.29,30.18 42.98,30.86 42.98,31.55 U1.30
  Bottom 0.254: v42.29,30.18 40.23,32.23 33.15,32.23 32.69,31.77 31.77,31.77 31.32,32.23 31.32,33.15 34.75,36.58 34.75,39.32 37.26,41.83 37.26,42.52 41.6,46.86 51.21,46.86 53.95,49.61 74.52,49.61 77.27,46.86 82.98,46.86 84.12,45.72 AR.2 84.35,45.72 84.35,38.18 94.18,28.35 94.18,13.26 90.07,9.14 88.01,9.14 87.1,10.06 87.1,10.74 85.95,11.89 85.95,12.8 SV2.6
RXM_HV_J  (via drill 0.61)
  Top 0.254: 30.4,38.63 30.18,38.41 27.89,38.41 27.2,37.72 27.2,36.12 29.95,33.38 Q5.3 | 30.4,38.63 30.4,40.01 29.72,40.69 27.43,40.69 22.4,45.72 21.49,45.72 20.57,46.63 20.57,48.92 19.43,50.06 9.14,50.06 8,48.92 8,45.72 9.6,44.12 R14.2 | v76.35,49.15 74.52,47.32 73.38,47.32 v72.47,48.23 | 30.4,38.63 v35.66,38.63
  Bottom 0.254: v76.35,49.15 76.58,49.38 82.53,49.38 83.44,48.46 84.12,48.46 AR.1 | v72.47,48.23 53.95,48.23 51.21,45.49 45.49,45.49 38.86,38.86 35.89,38.86 v35.66,38.63
RXM_LV  (via drill 0.61)
  Top 0.254: 31.09,29.95 31.09,22.63 34.06,19.66 34.06,17.83 | 31.09,29.95 31.09,31.09 Q5.2 | 34.06,17.83 34.06,16.69 T2.2 | 34.06,17.83 37.95,17.83 39.09,16.69 T1.2 | v20.8,43.43 20.34,43.89 19.2,43.89 R11.2 | v20.8,35.2 20.8,33.38 21.49,32.69 21.49,30.63 v22.4,29.72 | 31.09,29.95 v30.4,29.95
  Bottom 0.254: v20.8,35.2 v20.8,43.43 | v22.4,29.72 25.38,29.72 25.6,29.95 v30.4,29.95
SCK1  (via drill 0.61)
  Top 0.254: 21.49,15.32 21.03,15.77 20.34,15.77 Q6.3 | v33.38,11.2 33.6,11.2 34.75,10.06 34.75,5.94 PROGRAMMER1.4 | v49.61,23.55 48.69,24.46 U1.17 | v11.66,22.17 10.97,22.86 7.54,22.86 5.26,25.15 5.26,30.4 8,33.15 8,36.35 9.6,37.95 9.6,38.41 R25.2 | v18.29,21.72 18.97,21.72 19.2,21.95 20.57,21.95 24.69,17.83 24.69,16 24,15.32 21.49,15.32 | 21.49,15.32 v21.72,15.09
  Bottom 0.254: v21.72,15.09 29.49,15.09 v33.38,11.2 34.29,12.12 40.23,12.12 43.43,15.32 43.43,15.54 49.61,21.72 v49.61,23.55 | v11.66,22.17 16,22.17 16.46,21.72 v18.29,21.72
SW1  (via drill 0.61)
  Top 0.254: v16.92,22.63 14.86,20.57 14.86,19.2 S1.3 | v14.86,24.69 14.86,31.55 S1.4
  Bottom 0.254: SV1.4 16.69,47.55 16.69,37.72 13.72,34.75 13.72,32.69 14.63,31.77 S1.4 | v14.86,24.69 v16.92,22.63
TX
  Bottom 0.254: PROGRAMMER1.5 37.49,3.2 38.41,3.2 39.55,2.06 42.06,2.06 48.01,8 70.18,8 77.95,15.77 80.47,15.77 83.21,13.03 SV2.4
TX_REQ  (via drill 0.61)
  Top 0.254: v19.2,5.71 19.2,12.34 19.43,12.57 19.66,12.57 20.8,13.72 21.26,13.72 Q6.2 | v15.09,2.74 15.09,8.46 R19.2 | v78.87,14.86 78.41,15.32 78.41,18.97 80.24,20.8 80.24,28.35 79.1,29.49 77.5,29.49 U$1.12
  Bottom 0.254: v19.2,5.71 19.2,5.26 18.29,4.34 18.29,2.06 | 18.29,2.06 17.6,1.37 16.46,1.37 v15.09,2.74 | v78.87,14.86 80.47,14.86 82.07,13.26 82.07,12.57 82.98,11.66 83.67,11.66 84.58,10.74 84.58,10.06 77.5,2.97 44.35,2.97 42.29,0.91 19.43,0.91 18.29,2.06
TXB
  Top 0.254: T1.3 38.41,18.75 39.09,18.75 40.23,17.6 40.23,15.77 39.78,15.32 37.95,15.32 35.89,13.26 35.89,5.26 35.2,4.57 28.35,4.57 27.66,5.26 26.52,5.26 24.69,3.43 BT_H.4
TXE  (via drill 0.61)
  Top 0.254: SV2.1 80.7,10.52 80.7,11.43 79.55,12.57 79.55,13.49 80.24,14.17 87.1,14.17 88.24,13.03 SV2.8 | U$1.8 93.5,35.66 93.5,39.78 87.55,45.72 ET.1 | v88.24,35.66 v88.24,27.43
  Bottom 0.254: v88.24,27.43 88.24,13.03 SV2.8 | v88.24,35.66 88.24,45.03 87.55,45.72 ET.1
TXE_J  (via drill 0.61)
  Top 0.254: v32.23,32.69 30.86,32.69 30.18,32 30.18,31.09 29.49,30.4 29.49,29.49 30.4,28.57 30.4,22.63 32.92,20.12 32.92,18.97 T2.3 | v72.24,46.41 76.58,46.41 77.27,47.09 86.18,47.09 87.33,48.23 ET.2
  Bottom 0.254: v32.23,32.69 37.26,32.69 42.29,37.72 42.29,40.69 46.63,45.03 51.89,45.03 54.63,47.78 60.81,47.78 63.78,44.81 63.78,38.63 61.27,36.12 61.27,35.2 66.06,30.4 68.35,30.4 70.41,32.46 70.41,44.58 v72.24,46.41
TXM_HV  (via drill 0.61)
  Top 0.254: v62.18,35.66 60.12,37.72 56.46,37.72 55.09,36.35 52.35,36.35 48.92,32.92 42.75,32.92 42.29,32.46 42.29,31.77 U1.31 | v73.84,48.23 75.67,50.06 79.55,50.06 81.15,48.46 AT.2
  Bottom 0.254: v62.18,35.66 62.18,36.35 69.95,44.12 69.95,45.49 71.78,47.32 72.92,47.32 | v73.84,48.23 72.92,47.32 | 72.92,47.32 77.27,42.98 77.27,23.77 84.58,16.46 84.58,12.57 85.72,11.43 85.72,10.52 SV2.5
TXM_HV_J  (via drill 0.61)
  Top 0.254: v25.38,39.55 26.06,38.86 26.06,33.38 Q4.3 | v7.77,40.23 6.17,38.63 R9.2 | v79.1,42.98 74.98,42.98 74.52,42.52 67.44,42.52 66.52,43.43 66.52,45.03 63.55,48.01 v50.75,48.01
  Bottom 0.254: v25.38,39.55 25.38,44.35 23.09,46.63 23.09,48.92 | 23.09,48.92 22.4,49.61 8.69,49.61 7.77,48.69 v7.77,40.23 | v79.1,42.98 81.15,45.03 81.15,45.72 AT.1 | v50.75,48.01 50.29,48.01 49.61,47.32 47.32,47.32 45.03,49.61 23.77,49.61 23.09,48.92
TXM_LV  (via drill 0.61)
  Top 0.254: 83.44,19.43 82.75,18.75 82.75,18.52 T3.3 | 83.44,19.43 84.81,19.43 85.72,18.52 T4.3 | v25.15,32.46 25.38,32.46 26.52,31.32 26.98,31.32 Q4.2 | v14.63,34.29 14.63,36.58 12.8,38.41 R7.2 | v83.44,28.12 83.44,19.43 | v32.69,43.2 v39.32,43.2
  Bottom 0.254: v14.63,34.29 20.57,34.29 22.4,32.46 v25.15,32.46 25.15,36.35 32,43.2 v32.69,43.2 | v83.44,28.12 83.44,31.55 77.72,37.26 77.72,43.89 74.75,46.86 74.75,48.69 74.3,49.15 54.18,49.15 50.98,45.95 42.06,45.95 v39.32,43.2
VDD  (via drill 0.61)
  Top 0.254: 28.8,42.98 28.8,41.83 U3.3 28.8,41.6 29.49,41.6 31.55,39.55 42.98,39.55 C10.+ 43.2,39.32 v45.72,39.32 | 28.8,42.98 33.38,47.55 POWER.3 | 28.8,42.98 26.52,42.98 21.95,47.55 SV1.6 | R16.1 16,35.89 14.63,37.26 14.63,39.32 15.09,39.78 v17.6,39.78 17.83,39.78 18.97,38.63 R13.1 19.2,38.41 20.12,38.41 22.63,35.89 23.32,35.89 23.77,35.43 23.77,24.46 v24.69,23.55 | IC1.14 9.6,32.46 v9.6,34.06 9.6,35.66 R25.1 | R9.1 5.94,35.89 5.94,36.35 3.43,38.86 3.43,40.92 5.03,42.52 8.46,42.52 9.6,41.38 R14.1 9.83,41.38 10.97,42.52 10.97,45.03 | SV1.1 9.14,46.86 10.97,45.03 | v17.6,45.49 11.43,45.49 10.97,45.03 | R26.1 20.57,4.8 19.66,3.89 19.66,3.43 BT_H.2 19.43,3.2 16.23,6.4 16.23,9.14 17.6,10.52 17.6,11.2 R27.1 | R18.1 26.52,11.2 26.52,10.74 28.12,9.14 28.12,7.54 29.72,5.94 32.23,5.94 PROGRAMMER1.2 | 40.92,26.52 40.69,26.29 40.01,26.29 U1.6 | 40.92,26.52 40.92,27.43 40.69,27.66 40.01,27.66 U1.4 | 49.61,25.83 49.38,25.6 48.69,25.6 U1.18 | 49.61,25.83 49.61,26.52 49.15,26.98 48.69,26.98 U1.20 48.46,26.98 47.55,26.98 v47.09,26.52 | v68.58,14.86 77.5,5.94 79.1,5.94 R30.1 | 49.61,25.83 v53.03,25.83 | v42.06,26.52 40.92,26.52 | v30.63,3.2 31.77,2.06 40.23,2.06 42.75,4.57 42.75,14.17 41.6,15.32 41.6,17.6 v42.75,18.75
  Bottom 0.254: v9.6,34.06 12.12,36.58 12.12,44.58 9.14,47.55 SV1.1 | v17.6,45.49 v17.6,39.78 | 30.63,5.71 32.23,5.71 PROGRAMMER1.2 | 30.63,5.71 21.95,5.71 19.66,3.43 BT_H.2 | 61.27,14.86 60.58,14.86 57.84,17.6 57.84,21.03 v53.03,25.83 | 61.27,14.86 v68.58,14.86 | v47.09,26.52 42.98,26.52 | 42.98,26.52 v42.06,26.52 | v30.63,3.2 30.63,5.71 | 42.75,21.95 42.75,24 42.98,24.23 42.98,26.52 | 42.75,21.95 v42.75,18.75 | v24.69,23.55 25.38,23.55 26.98,21.95 42.75,21.95 | v45.72,39.32 49.38,39.32 50.52,38.18 50.52,31.77 58.29,24 58.29,22.63 61.27,19.66 61.27,14.86
VSS  (via drill 0.61)
  Top 0.254: 85.27,4.34 85.5,4.34 86.64,3.2 C8.2 | 85.27,4.34 82.98,4.34 82.75,4.12 82.75,3.89 82.07,3.2 C9.2 | 85.27,4.34 86.64,5.71 C15.2 | 91.44,10.52 92.81,10.52 R2.2 | 91.44,10.52 86.87,5.94 C15.2 | v91.9,21.49 93.5,21.49 U$1.1 | 91.44,10.52 v91.44,11.89 | LED6.K 74.3,16.46 74.3,13.49 77.27,10.52 BOOT/FLASH.2 77.5,10.52 78.87,9.14 82.98,9.14 86.18,5.94 86.64,5.94 C15.2 | v52.58,27.66 48.69,27.66 U1.21 | POWER.1 38.63,47.55 40.69,45.49 43.66,45.49 C12.- 43.89,45.26 48.23,40.92 48.23,39.55 C10.- | v49.61,37.72 49.61,38.18 48.46,39.32 C10.- | R31.2 23.32,8.46 23.32,5.03 22.17,3.89 22.17,3.43 BT_H.3 21.95,3.2 21.95,2.52 20.34,0.91 14.63,0.91 9.6,5.94 9.6,8.46 C2.2 9.37,8.69 8.69,8.69 5.71,11.66 C1.- 5.71,11.89 5.71,18.06 | v4.34,39.55 5.94,41.15 R1.1 | 5.71,18.06 2.74,18.06 1.6,16.92 IC1.7 | 5.71,18.06 v6.63,18.06 | C7.2 29.49,11.43 29.95,11.43 32.69,14.17 ESP_RST.4 | 39.32,14.17 40.69,15.54 40.69,17.83 40.01,18.52 C5.1 39.78,20.57 39.78,21.95 38.41,23.32 38.41,26.52 39.09,27.2 | 39.32,14.17 42.29,11.2 42.29,6.63 40.01,4.34 40.01,3.43 PROGRAMMER1.7 | 39.32,14.17 ESP_RST.3 | v19.89,22.86 19.89,31.55 S1.2 | 39.09,27.2 39.78,27.2 U1.5 | 39.09,27.2 38.86,27.43 38.86,28.35 39.09,28.57 | 39.09,28.57 39.78,28.57 U1.3 | 39.78,36.58 39.78,34.29 | 39.32,37.03 39.78,36.58 | 39.09,28.57 39.09,28.8 38.86,29.03 38.86,33.38 39.78,34.29 | 39.78,34.29 C6.1 | U3.1 28.8,37.03 32.69,37.03 RST1.3 32.92,37.03 39.32,37.03 | 39.32,37.03 RST1.4 39.78,36.58 | 39.78,36.58 44.35,36.58 47.09,39.32 48.23,39.32 C10.- | v62.18,20.12 61.72,20.12 59.89,18.29 S4.2
  Bottom 0.254: v91.9,21.49 90.98,22.4 90.98,23.32 91.44,23.77 92.35,23.77 93.73,22.4 93.73,14.17 v91.44,11.89 | LED3.K 74.3,43.89 74.3,34.98 LED4.K 74.3,34.75 74.3,32.23 76.35,30.18 76.35,27.66 74.3,25.6 LED5.K 74.3,25.38 74.3,24.46 76.35,22.4 76.35,20.12 | BOOT/FLASH.2 77.27,10.29 77.27,9.83 74.3,6.86 LED7.K 74.07,6.86 72.69,5.49 59.89,5.49 S4.1 | 76.35,20.12 76.35,18.75 74.3,16.69 LED6.K | S4.2 59.89,20.34 v52.58,27.66 52.58,29.03 50.06,31.55 50.06,37.26 v49.61,37.72 | POWER.1 36.58,45.72 33.15,45.72 31.32,47.55 29.49,47.55 SV1.9 | v4.34,39.55 4.34,32.92 3.89,32.46 3.89,31.09 5.26,29.72 5.26,22.86 6.4,21.72 6.4,18.29 v6.63,18.06 | ESP_RST.4 32.92,14.17 39.32,14.17 ESP_RST.3 | v19.89,22.86 19.89,19.2 S1.1 | SV1.5 19.43,47.55 23.55,43.43 24.23,43.43 24.69,42.98 24.69,40.23 24.46,40.01 24.46,39.09 24.92,38.63 26.75,38.63 32.23,44.12 33.15,44.12 34.75,42.52 34.75,40.01 32.92,38.18 32.92,37.26 RST1.3 32.69,37.03 26.29,30.63 21.95,30.63 21.03,31.55 19.89,31.55 S1.2 | BT_H.3 22.17,3.2 24,1.37 32,1.37 33.6,2.97 33.6,3.66 34.52,4.57 38.63,4.57 39.78,3.43 PROGRAMMER1.7 | v62.18,20.12 76.35,20.12
  pour Top (isolate 0.61): 0,50.8 0,0 95.25,0 95.25,50.8
  pour Bottom (isolate 0.61): 0,50.8 0,0 95.25,0 95.25,50.8